# EAGLE design DRIVER_8 MOTOR_MEGA_DISTANCE_SENSOR_V1.0 (EAGLE 7.6.0)
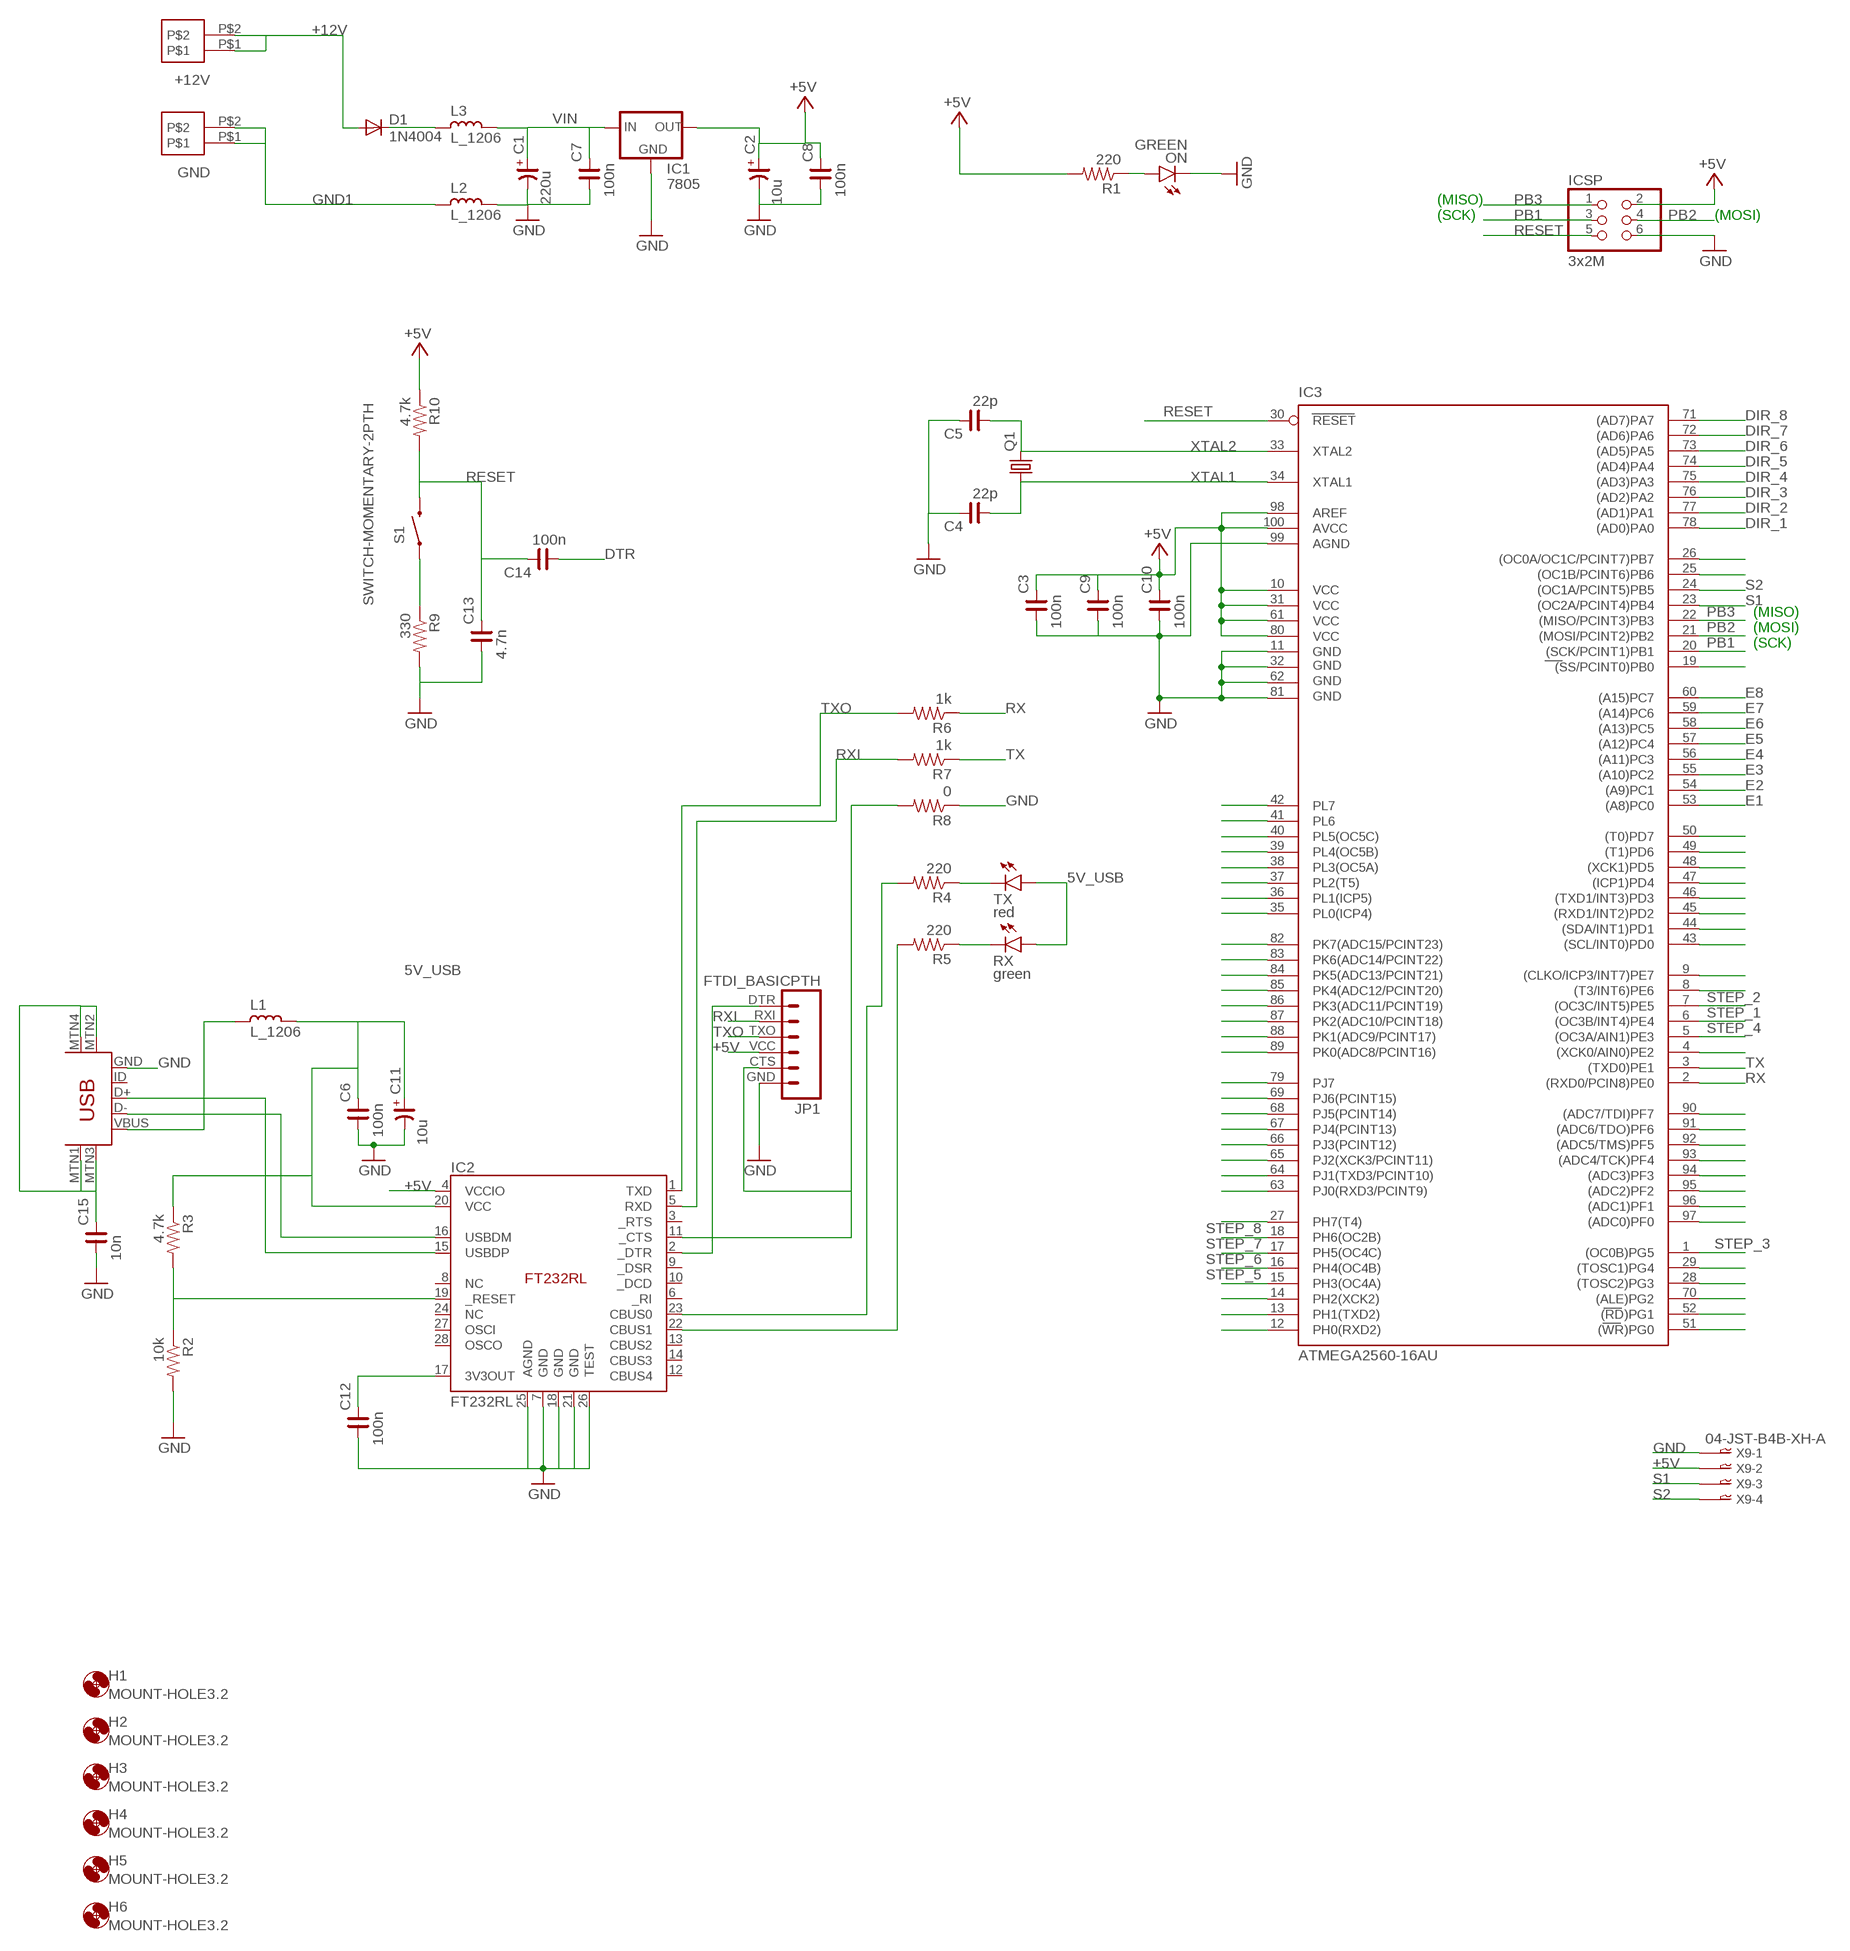
[diagram p0: schematic, sheet 1, part 1 of 2]
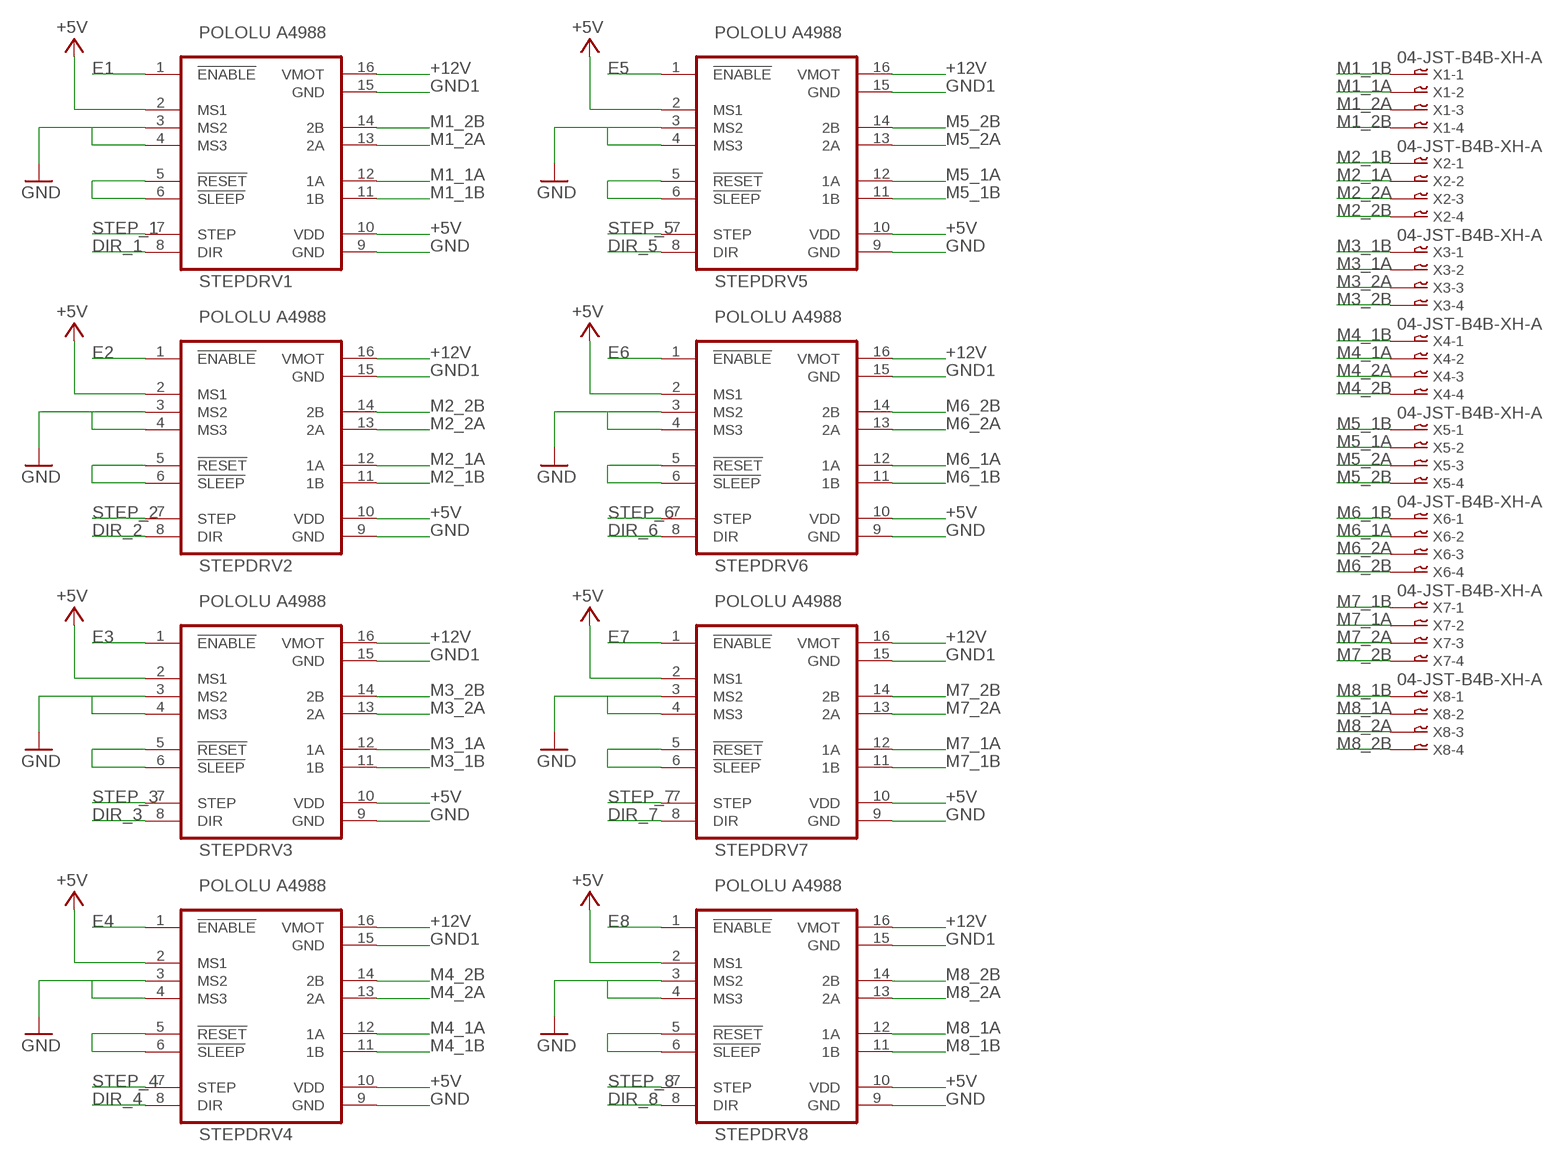
[diagram p1: schematic, sheet 1, part 2 of 2]

## Parts
+12V  SCREW_T_10MM  [SCREW_T_10MM]
C1  220u  CP_E-050X100  [CE-050X100]
C2  10u  CP_E-050X100  [CE-050X100]
C3  100n  C_C050-075X030  [C050-075X030]
C4  22p  C_C050-075X030  [C050-075X030]
C5  22p  C_C050-075X030  [C050-075X030]
C6  100n  C_C050-075X030  [C050-075X030]
C7  100n  C_C050-075X030  [C050-075X030]
C8  100n  C_C050-075X030  [C050-075X030]
C9  100n  C_C050-075X030  [C050-075X030]
C10  100n  C_C050-075X030  [C050-075X030]
C11  10u  CP_E-025X060  [CE-025X060]
C12  100n  C_C050-075X030  [C050-075X030]
C13  4.7n  C_C050-075X030  [C050-075X030]
C14  100n  C_C050-075X030  [C050-075X030]
C15  10n  C_C050-075X030  [C050-075X030]
D1  1N4004  [DO41-10]
GND  SCREW_T_10MM  [SCREW_T_10MM]
H1  MOUNT-HOLE3.2  [3,2]
H2  MOUNT-HOLE3.2  [3,2]
H3  MOUNT-HOLE3.2  [3,2]
H4  MOUNT-HOLE3.2  [3,2]
H5  MOUNT-HOLE3.2  [3,2]
H6  MOUNT-HOLE3.2  [3,2]
IC1  7805  V_REG_78XX-TO-220  [TO-220-ALT]
IC2  FT232RL  [SSOP-28]
IC3  ATMEGA2560-16AU  ATMEGA25602560-16AU  [TQFP100]
ICSP  3x2M  PINHD-2X3  [2X03]
JP1  FTDI_BASICPTH  [FTDI_BASIC]
L1  L_1206  [L1206]
L2  L_1206  [L1206]
L3  L_1206  [L1206]
ON  GREEN  LED3MM  [LED3MM]
Q1  CRYSTALHC49S  [HC49/S]
R1  220  0.75OHM1/4W1%(0805)  [0805]
R2  10k  0.75OHM1/4W1%(0805)  [0805]
R3  4.7k  0.75OHM1/4W1%(0805)  [0805]
R4  220  0.75OHM1/4W1%(0805)  [0805]
R5  220  0.75OHM1/4W1%(0805)  [0805]
R6  1k  0.75OHM1/4W1%(0805)  [0805]
R7  1k  0.75OHM1/4W1%(0805)  [0805]
R8  0  0.75OHM1/4W1%(0805)  [0805]
R9  330  0.75OHM1/4W1%(0805)  [0805]
R10  4.7k  0.75OHM1/4W1%(0805)  [0805]
RX  green  LED3MM  [LED3MM]
S1  SWITCH-MOMENTARY-2PTH  [TACTILE-PTH]
STEPDRV1  POLOLU A4988  POLOLULU2128  [POLOLULU2128]
STEPDRV2  POLOLU A4988  POLOLULU2128  [POLOLULU2128]
STEPDRV3  POLOLU A4988  POLOLULU2128  [POLOLULU2128]
STEPDRV4  POLOLU A4988  POLOLULU2128  [POLOLULU2128]
STEPDRV5  POLOLU A4988  POLOLULU2128  [POLOLULU2128]
STEPDRV6  POLOLU A4988  POLOLULU2128  [POLOLULU2128]
STEPDRV7  POLOLU A4988  POLOLULU2128  [POLOLULU2128]
STEPDRV8  POLOLU A4988  POLOLULU2128  [POLOLULU2128]
TX  red  LED3MM  [LED3MM]
U$1  USB-MINIB-5PIN  [USB-MINIB]
X1  04-JST-B4B-XH-A  [B4B-XH]
X2  04-JST-B4B-XH-A  [B4B-XH]
X3  04-JST-B4B-XH-A  [B4B-XH]
X4  04-JST-B4B-XH-A  [B4B-XH]
X5  04-JST-B4B-XH-A  [B4B-XH]
X6  04-JST-B4B-XH-A  [B4B-XH]
X7  04-JST-B4B-XH-A  [B4B-XH]
X8  04-JST-B4B-XH-A  [B4B-XH]
X9  04-JST-B4B-XH-A  [B4B-XH]

## Nets
5V_USB: C6.2 C11.+ IC2.20(VCC) L1.1 R3.1 RX.A TX.A
+5V [power usb]: C2.+ C3.2 C8.2 C9.2 C10.2 IC1.OUT IC2.4(VCCIO) IC3.10(VCC) IC3.31(VCC1) IC3.61(VCC2) IC3.80(VCC3) IC3.98(AREF) IC3.100(AVCC) ICSP.2 JP1.VCC R1.2 R10.1 STEPDRV1.2(MS1) STEPDRV1.10(VDD) STEPDRV2.2(MS1) STEPDRV2.10(VDD) STEPDRV3.2(MS1) STEPDRV3.10(VDD) STEPDRV4.2(MS1) STEPDRV4.10(VDD) STEPDRV5.2(MS1) STEPDRV5.10(VDD) STEPDRV6.2(MS1) STEPDRV6.10(VDD) STEPDRV7.2(MS1) STEPDRV7.10(VDD) STEPDRV8.2(MS1) STEPDRV8.10(VDD) X9.P$2
+12V: +12V.P$1 +12V.P$2 D1.A STEPDRV1.16(VMOT) STEPDRV2.16(VMOT) STEPDRV3.16(VMOT) STEPDRV4.16(VMOT) STEPDRV5.16(VMOT) STEPDRV6.16(VMOT) STEPDRV7.16(VMOT) STEPDRV8.16(VMOT)
DIR_1: IC3.78((AD0)PA0) STEPDRV1.8(DIR)
DIR_2: IC3.77((AD1)PA1) STEPDRV2.8(DIR)
DIR_3: IC3.76((AD2)PA2) STEPDRV3.8(DIR)
DIR_4: IC3.75((AD3)PA3) STEPDRV4.8(DIR)
DIR_5: IC3.74((AD4)PA4) STEPDRV5.8(DIR)
DIR_6: IC3.73((AD5)PA5) STEPDRV6.8(DIR)
DIR_7: IC3.72((AD6)PA6) STEPDRV7.8(DIR)
DIR_8: IC3.71((AD7)PA7) STEPDRV8.8(DIR)
DTR: C14.1 IC2.2(_DTR) JP1.DTR
E1: IC3.53((A8)PC0) STEPDRV1.1(!ENABLE)
E2: IC3.54((A9)PC1) STEPDRV2.1(!ENABLE)
E3: IC3.55((A10)PC2) STEPDRV3.1(!ENABLE)
E4: IC3.56((A11)PC3) STEPDRV4.1(!ENABLE)
E5: IC3.57((A12)PC4) STEPDRV5.1(!ENABLE)
E6: IC3.58((A13)PC5) STEPDRV6.1(!ENABLE)
E7: IC3.59((A14)PC6) STEPDRV7.1(!ENABLE)
E8: IC3.60((A15)PC7) STEPDRV8.1(!ENABLE)
GND [gnd]: C1.- C2.- C3.1 C4.2 C5.2 C6.1 C7.1 C8.1 C9.1 C10.1 C11.- C12.1 C13.1 C15.1 IC1.GND IC2.7(GND) IC2.18(GND) IC2.21(GND) IC2.25(AGND) IC2.26(TEST) IC3.11(GND) IC3.32(GND1) IC3.62(GND2) IC3.81(GND3) IC3.99(AGND) ICSP.6 JP1.GND L2.1 ON.K(C) R2.2 R8.1 R9.2 STEPDRV1.3(MS2) STEPDRV1.4(MS3) STEPDRV1.9(GND) STEPDRV2.3(MS2) STEPDRV2.4(MS3) STEPDRV2.9(GND) STEPDRV3.3(MS2) STEPDRV3.4(MS3) STEPDRV3.9(GND) STEPDRV4.3(MS2) STEPDRV4.4(MS3) STEPDRV4.9(GND) STEPDRV5.3(MS2) STEPDRV5.4(MS3) STEPDRV5.9(GND) STEPDRV6.3(MS2) STEPDRV6.4(MS3) STEPDRV6.9(GND) STEPDRV7.3(MS2) STEPDRV7.4(MS3) STEPDRV7.9(GND) STEPDRV8.3(MS2) STEPDRV8.4(MS3) STEPDRV8.9(GND) U$1.GND X9.P$1
GND1: GND.P$1 GND.P$2 L2.2 STEPDRV1.15(GND) STEPDRV2.15(GND) STEPDRV3.15(GND) STEPDRV4.15(GND) STEPDRV5.15(GND) STEPDRV6.15(GND) STEPDRV7.15(GND) STEPDRV8.15(GND)
M1_1A: STEPDRV1.12(1A) X1.P$2
M1_1B: STEPDRV1.11(1B) X1.P$1
M1_2A: STEPDRV1.13(2A) X1.P$3
M1_2B: STEPDRV1.14(2B) X1.P$4
M2_1A: STEPDRV2.12(1A) X2.P$2
M2_1B: STEPDRV2.11(1B) X2.P$1
M2_2A: STEPDRV2.13(2A) X2.P$3
M2_2B: STEPDRV2.14(2B) X2.P$4
M3_1A: STEPDRV3.12(1A) X3.P$2
M3_1B: STEPDRV3.11(1B) X3.P$1
M3_2A: STEPDRV3.13(2A) X3.P$3
M3_2B: STEPDRV3.14(2B) X3.P$4
M4_1A: STEPDRV4.12(1A) X4.P$2
M4_1B: STEPDRV4.11(1B) X4.P$1
M4_2A: STEPDRV4.13(2A) X4.P$3
M4_2B: STEPDRV4.14(2B) X4.P$4
M5_1A: STEPDRV5.12(1A) X5.P$2
M5_1B: STEPDRV5.11(1B) X5.P$1
M5_2A: STEPDRV5.13(2A) X5.P$3
M5_2B: STEPDRV5.14(2B) X5.P$4
M6_1A: STEPDRV6.12(1A) X6.P$2
M6_1B: STEPDRV6.11(1B) X6.P$1
M6_2A: STEPDRV6.13(2A) X6.P$3
M6_2B: STEPDRV6.14(2B) X6.P$4
M7_1A: STEPDRV7.12(1A) X7.P$2
M7_1B: STEPDRV7.11(1B) X7.P$1
M7_2A: STEPDRV7.13(2A) X7.P$3
M7_2B: STEPDRV7.14(2B) X7.P$4
M8_1A: STEPDRV8.12(1A) X8.P$2
M8_1B: STEPDRV8.11(1B) X8.P$1
M8_2A: STEPDRV8.13(2A) X8.P$3
M8_2B: STEPDRV8.14(2B) X8.P$4
N$1: L1.2 U$1.VBUS
N$2: IC2.16(USBDM) U$1.D-
N$3: ON.A R1.1
N$4: STEPDRV2.5(!RESET) STEPDRV2.6(!SLEEP)
N$5: STEPDRV3.5(!RESET) STEPDRV3.6(!SLEEP)
N$6: IC2.15(USBDP) U$1.D+
N$7: IC3.14(PH2(XCK2))
N$8: STEPDRV1.5(!RESET) STEPDRV1.6(!SLEEP)
N$9: STEPDRV4.5(!RESET) STEPDRV4.6(!SLEEP)
N$10: STEPDRV5.5(!RESET) STEPDRV5.6(!SLEEP)
N$11: STEPDRV6.5(!RESET) STEPDRV6.6(!SLEEP)
N$12: STEPDRV7.5(!RESET) STEPDRV7.6(!SLEEP)
N$13: STEPDRV8.5(!RESET) STEPDRV8.6(!SLEEP)
N$14: C12.2 IC2.17(3V3OUT)
N$15: D1.C L3.2
N$16: R4.1 TX.K(C)
N$17: R5.1 RX.K(C)
N$18: C15.2 U$1.MTN1(MTN2) U$1.MTN2(MTN3) U$1.MTN3(MTN1) U$1.MTN4
N$19: IC3.27(PH7(T4))
N$20: IC3.49((T1)PD6)
N$21: IC3.48((XCK1)PD5)
N$22: IC3.47((ICP1)PD4)
N$23: IC3.46((TXD1/INT3)PD3)
N$24: IC3.45((RXD1/INT2)PD2)
N$25: IC3.44((SDA/INT1)PD1)
N$26: IC3.43((SCL/INT0)PD0)
N$27: IC3.9((CLKO/ICP3/INT7)PE7)
N$28: IC3.8((T3/INT6)PE6)
N$29: IC3.4((XCK0/AIN0)PE2)
N$30: IC2.23(CBUS0) R4.2
N$31: IC2.22(CBUS1) R5.2
N$32: IC3.90((ADC7/TDI)PF7)
N$33: IC3.91((ADC6/TDO)PF6)
N$34: IC3.92((ADC5/TMS)PF5)
N$35: IC3.93((ADC4/TCK)PF4)
N$36: IC3.94((ADC3)PF3)
N$37: IC3.95((ADC2)PF2)
N$38: IC3.96((ADC1)PF1)
N$39: IC3.97((ADC0)PF0)
N$40: IC3.29((TOSC1)PG4)
N$41: IC3.28((TOSC2)PG3)
N$42: IC3.65(PJ2(XCK3/PCINT11))
N$43: IC3.66(PJ3(PCINT12))
N$44: IC3.67(PJ4(PCINT13))
N$45: IC3.68(PJ5(PCINT14))
N$46: IC3.69(PJ6(PCINT15))
N$47: IC3.79(PJ7)
N$48: IC3.89(PK0(ADC8/PCINT16))
N$49: IC3.88(PK1(ADC9/PCINT17))
N$50: IC3.87(PK2(ADC10/PCINT18))
N$51: IC3.86(PK3(ADC11/PCINT19))
N$52: IC3.85(PK4(ADC12/PCINT20))
N$53: IC3.84(PK5(ADC13/PCINT21))
N$54: IC3.83(PK6(ADC14/PCINT22))
N$55: IC3.82(PK7(ADC15/PCINT23))
N$57: IC2.11(_CTS) JP1.CTS R8.2
N$59: R9.1 S1.1
N$60: IC2.19(_RESET) R2.1 R3.2
PB0: IC3.19((SS/PCINT0)PB0)
PB1: IC3.20((SCK/PCINT1)PB1) ICSP.3
PB2: IC3.21((MOSI/PCINT2)PB2) ICSP.4
PB3: IC3.22((MISO/PCINT3)PB3) ICSP.1
PB6: IC3.25((OC1B/PCINT6)PB6)
PB7: IC3.26((OC0A/OC1C/PCINT7)PB7)
PD7: IC3.50((T0)PD7)
PG0: IC3.51((WR)PG0)
PG1: IC3.52((RD)PG1)
PG2: IC3.70((ALE)PG2)
PL0: IC3.35(PL0(ICP4))
PL1: IC3.36(PL1(ICP5))
PL2: IC3.37(PL2(T5))
PL3: IC3.38(PL3(OC5A))
PL4: IC3.39(PL4(OC5B))
PL5: IC3.40(PL5(OC5C))
PL6: IC3.41(PL6)
PL7: IC3.42(PL7)
RESET: C13.2 C14.2 IC3.30(RESET) ICSP.5 R10.2 S1.3
RX: IC3.2((RXD0/PCIN8)PE0) R6.1
RXD2: IC3.12(PH0(RXD2))
RXD3: IC3.63(PJ0(RXD3/PCINT9))
RXI: IC2.5(RXD) JP1.RXI R7.2
S1: IC3.23((OC2A/PCINT4)PB4) X9.P$3
S2: IC3.24((OC1A/PCINT5)PB5) X9.P$4
STEP_1: IC3.6((OC3B/INT4)PE4) STEPDRV1.7(STEP)
STEP_2: IC3.7((OC3C/INT5)PE5) STEPDRV2.7(STEP)
STEP_3: IC3.1((OC0B)PG5) STEPDRV3.7(STEP)
STEP_4: IC3.5((OC3A/AIN1)PE3) STEPDRV4.7(STEP)
STEP_5: IC3.15(PH3(OC4A)) STEPDRV5.7(STEP)
STEP_6: IC3.16(PH4(OC4B)) STEPDRV6.7(STEP)
STEP_7: IC3.17(PH5(OC4C)) STEPDRV7.7(STEP)
STEP_8: IC3.18(PH6(OC2B)) STEPDRV8.7(STEP)
TX: IC3.3((TXD0)PE1) R7.1
TXD2: IC3.13(PH1(TXD2))
TXD3: IC3.64(PJ1(TXD3/PCINT10))
TXO: IC2.1(TXD) JP1.TXO R6.2
VIN [power]: C1.+ C7.2 IC1.IN L3.1
XTAL1: C4.1 IC3.34(XTAL1) Q1.1
XTAL2: C5.1 IC3.33(XTAL2) Q1.2
Unconnected: IC2.3(_RTS) IC2.6(_RI) IC2.8(NC) IC2.9(_DSR) IC2.10(_DCD) IC2.12(CBUS4) IC2.13(CBUS2) IC2.14(CBUS3) IC2.24(NC) IC2.27(OSCI) IC2.28(OSCO) U$1.ID

## Notes on the sheet
- (MISO)
- (SCK) | (MOSI)
- (MISO)
- (MOSI)
- (SCK)

## Library data of the parts
+12V GND = screw_2p_10mm:SCREW_T_10MM
C1 C2 C11 = rc-master:CP_: POLARIZED CAP
C3-C10 C12-C15 = rc-master:C_: NON-POLARIZED CAP
D1 = diode:1N4004: DIODE general purpose rectifier, 1 A
H1-H6 = holes:MOUNT-HOLE: MOUNTING HOLE with drill center marker
IC1 = SparkFun-PowerIC:V_REG_78XX: Voltage Regulator Standard 7805 5V regulator. IGO (Input Ground Output). Spark Fun Electronics SKU : COM-00107
IC2 = ftdi4:FT232RL
IC3 = SmartPrj:ATMEGA2560: MICROCONTROLLER 64/128/256 Kbytes FLASH 4 Kbytes EEPROM 8 Kbytes SRAM 86 General Purpose I/O pins 12-channels16-bit PWM 4 x Serial USARTs 16-channels 10-bit A/D
ICSP = SmartPrj:PINHD-2X3: PIN HEADER
JP1 = SparkFun-Connectors:FTDI_BASIC: FTDI Basic header with labels
L1-L3 = rc-master-smd:L_: INDUCTOR
ON RX TX = SparkFun-LED:LED: LEDs Standard schematic elements and footprints for 5mm, 3mm, 1206, and 0603 sized LEDs. 5mm - Spark Fun Electronics SKU : COM-00529 (and others)
Q1 = crystal:CRYSTAL: CRYSTAL; OC_FARNELL: 1667008; OC_NEWARK: unknown
R1-R10 = SparkFun-Resistors:0.75OHM1/4W1%(0805): RES-08474; PROD_ID: RES-08474; VALUE: 0.75
S1 = SparkFun-Electromechanical:SWITCH-MOMENTARY-2: Various NO switches- pushbuttons, reed, etc
STEPDRV1-STEPDRV8 = stepper_drivers_etc:POLOLULU2128
U$1 = SparkFun-Connectors:USB-MINIB: Mini-USB "B" connector with 5th pin broken out. Created new symbol breaking out 5th "ID" pin in mini/micro USB connector spec. See: http://en.wikipedia.org/wiki/Mini_usb#Cables. Uses same footprint as 4-pin symbol. Also added pins to connect to mounting / shield pads if required (probably not generally needed as signals aren't shielded once they leave the connector).
X1-X9 = con-jst-xh:04-JST: JST CONNECTOR

## Net classes
0 default: width 0.203 mm, drill 0.406 mm, clearance 0.203 mm
1 power: width 0.61 mm, drill 0.406 mm, clearance 0.203 mm
2 gnd: width 0.305 mm, drill 0.406 mm, clearance 0.203 mm
3 power usb: width 0.508 mm, drill 0.406 mm, clearance 0.203 mm

## Board
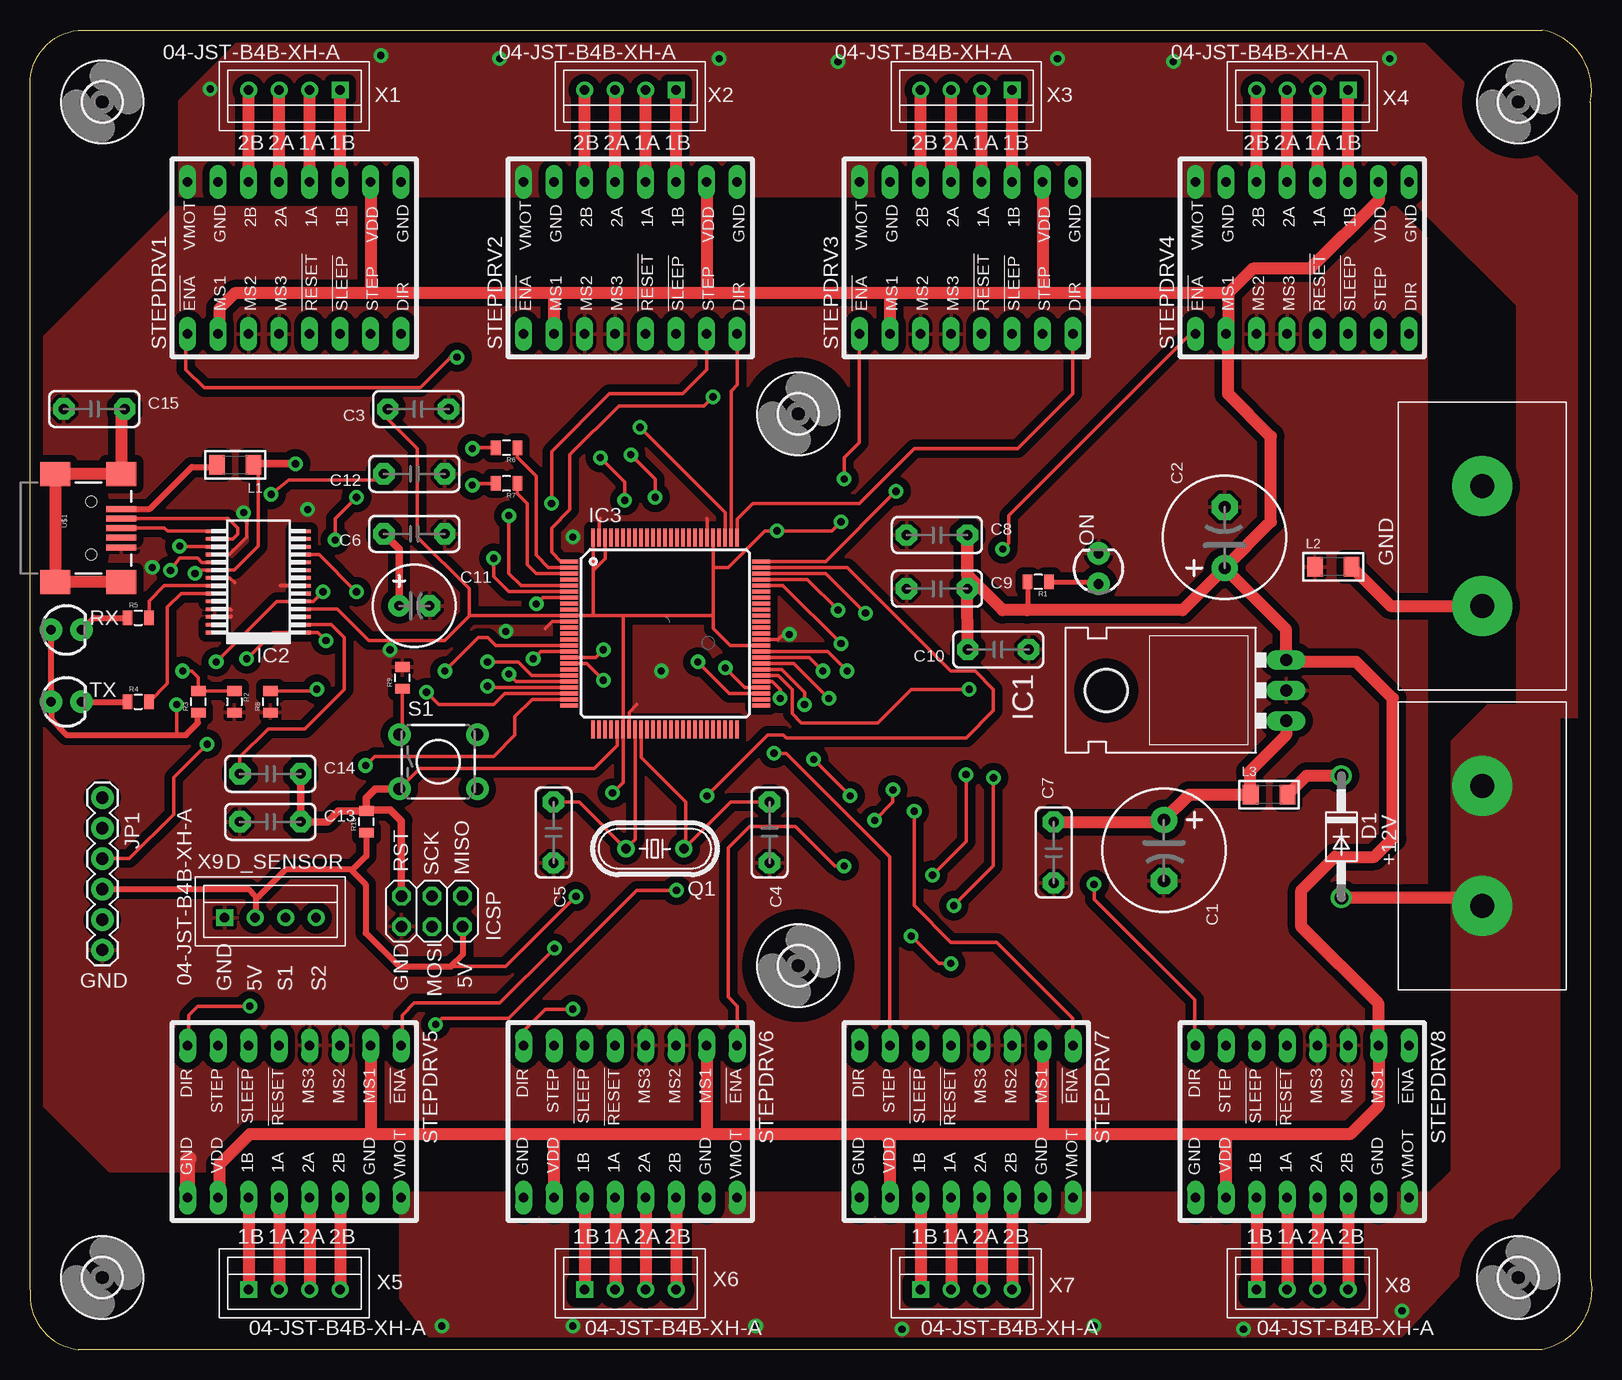
[diagram p2: board, top side]
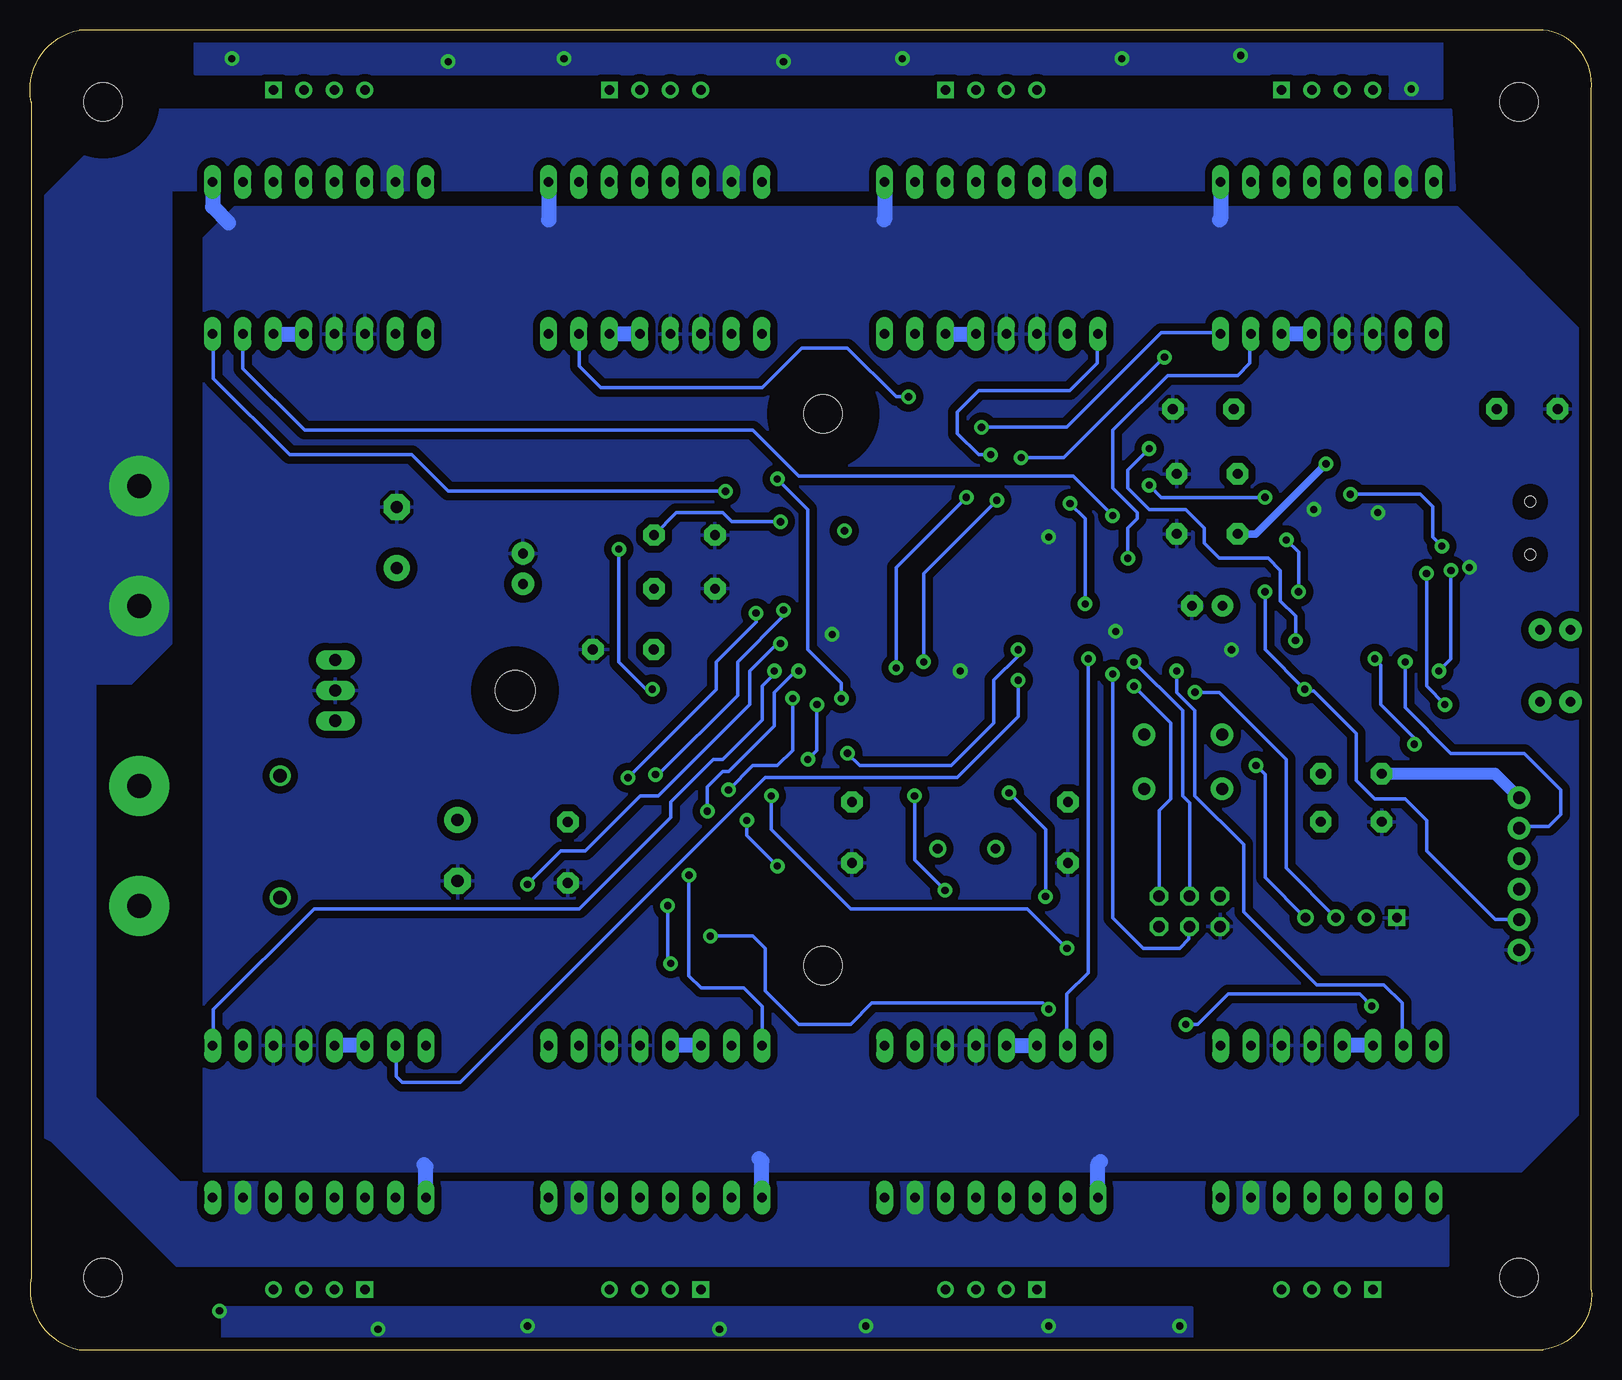
[diagram p3: board, bottom side, seen from below]

Size 130.13 x 110 mm. Coordinates in mm from the lower left corner, seen from the top.
Outline: 130.03,104 130.03,6 arc-90 126.03,0 4.03,0 arc-90 0.03,5 0.03,105 arc-90 4.03,110 126.03,110 arc-90 130.03,104
Copper layers (1*16): Top 0.035mm / dielectric 1.5mm / Bottom 0.035mm
Design rules "default *": minimum track width 10mil, minimum drill 28mil, track to track 8mil, track to pad 8mil, pad to pad 8mil, via to via 8mil, smd to smd 8mil, copper to edge 40mil, drill to drill 12mil, minimum pad ring 12mil, minimum via ring 12mil, stop-mask expansion 4mil, vias tented up to drill 0mil, thermal gap 12mil

### Footprints (pad centres in the part's own frame; a part is rotated, then mirrored left to right if it is on the bottom)
SCREW_T_10MM = drill 2 pad 5: P$1 3,3; P$2 13,3
CE-050X100 = drill 1.016 pad 2.184: + -2.54,0 | drill 1.016 pad 2.184 octagon: - 2.54,0
C050-075X030 = drill 0.813 pad 1.778 octagon: 1 -2.54,0; 2 2.54,0
CE-025X060 = drill 0.813 pad 1.778: + -1.27,0 | drill 0.813 pad 1.778 octagon: - 1.27,0
DO41-10 = drill 1.118: A 5.08,0; C -5.08,0
3,2 = hole 3.2: 0,0
TO-220-ALT = drill 1.016 long: GND 0,-3.81; IN -2.54,-3.81; OUT 2.54,-3.81 | hole 3.302: 0,11.176
SSOP-28 = smd 0.3 x 1.5: 1 -4.225,-3.625; 2 -3.575,-3.625; 3 -2.925,-3.625; 4 -2.275,-3.625; 5 -1.625,-3.625; 6 -0.975,-3.625; 7 -0.325,-3.625; 8 0.325,-3.625; 9 0.975,-3.625; 10 1.625,-3.625; 11 2.275,-3.625; 12 2.925,-3.625; 13 3.575,-3.625; 14 4.225,-3.625; 15 4.225,3.625; 16 3.575,3.625; 17 2.925,3.625; 18 2.275,3.625; 19 1.625,3.625; 20 0.975,3.625; 21 0.325,3.625; 22 -0.325,3.625; 23 -0.975,3.625; 24 -1.625,3.625; 25 -2.275,3.625; 26 -2.925,3.625; 27 -3.575,3.625; 28 -4.225,3.625
TQFP100 = smd 1.5 x 0.3: 1 -8,6; 2 -8,5.5; 3 -8,5; 4 -8,4.5; 5 -8,4; 6 -8,3.5; 7 -8,3; 8 -8,2.5; 9 -8,2; 10 -8,1.5; 11 -8,1; 12 -8,0.5; 13 -8,0; 14 -8,-0.5; 15 -8,-1; 16 -8,-1.5; 17 -8,-2; 18 -8,-2.5; 19 -8,-3; 20 -8,-3.5; 21 -8,-4; 22 -8,-4.5; 23 -8,-5; 24 -8,-5.5; 25 -8,-6; 51 8,-6; 52 8,-5.5; 53 8,-5; 54 8,-4.5; 55 8,-4; 56 8,-3.5; 57 8,-3; 58 8,-2.5; 59 8,-2; 60 8,-1.5; 61 8,-1; 62 8,-0.5; 63 8,0; 64 8,0.5; 65 8,1; 66 8,1.5; 67 8,2; 68 8,2.5; 69 8,3; 70 8,3.5; 71 8,4; 72 8,4.5; 73 8,5; 74 8,5.5; 75 8,6 | smd 0.3 x 1.5: 26 -6,-8; 27 -5.5,-8; 28 -5,-8; 29 -4.5,-8; 30 -4,-8; 31 -3.5,-8; 32 -3,-8; 33 -2.5,-8; 34 -2,-8; 35 -1.5,-8; 36 -1,-8; 37 -0.5,-8; 38 0,-8; 39 0.5,-8; 40 1,-8; 41 1.5,-8; 42 2,-8; 43 2.5,-8; 44 3,-8; 45 3.5,-8; 46 4,-8; 47 4.5,-8; 48 5,-8; 49 5.5,-8; 50 6,-8; 76 6,8; 77 5.5,8; 78 5,8; 79 4.5,8; 80 4,8; 81 3.5,8; 82 3,8; 83 2.5,8; 84 2,8; 85 1.5,8; 86 1,8; 87 0.5,8; 88 0,8; 89 -0.5,8; 90 -1,8; 91 -1.5,8; 92 -2,8; 93 -2.5,8; 94 -3,8; 95 -3.5,8; 96 -4,8; 97 -4.5,8; 98 -5,8; 99 -5.5,8; 100 -6,8
2X03 = drill 0.95 pad 1.55 octagon: 1 -2.54,-1.27; 2 -2.54,1.27; 3 0,-1.27; 4 0,1.27; 5 2.54,-1.27; 6 2.54,1.27
FTDI_BASIC = drill 1.016 pad 1.88: CTS 10.16,0; DTR 0,0; GND 12.7,0; RXI 2.54,0; TXO 5.08,0; VCC 7.62,0
L1206 = smd 1.3 x 1.6: 1 -1.524,0; 2 1.524,0
LED3MM = drill 0.813 pad 1.88: A -1.27,0; K 1.27,0
HC49/S = drill 0.813: 1 -2.413,0; 2 2.413,0
0805 = smd 0.8 x 1.2: 1 -0.9,0; 2 0.9,0
TACTILE-PTH = drill 1.016 pad 1.88: 1 -3.251,2.261; 2 3.251,2.261; 3 -3.251,-2.261; 4 3.251,-2.261
POLOLULU2128 = drill 0.8 long: 1 -6.35,8.89; 2 -6.35,6.35; 3 -6.35,3.81; 4 -6.35,1.27; 5 -6.35,-1.27; 6 -6.35,-3.81; 7 -6.35,-6.35; 8 -6.35,-8.89; 9 6.35,-8.89; 10 6.35,-6.35; 11 6.35,-3.81; 12 6.35,-1.27; 13 6.35,1.27; 14 6.35,3.81; 15 6.35,6.35; 16 6.35,8.89
USB-MINIB = smd 2.5 x 0.5: D+ 2.5,0; D- 2.5,0.8; GND 2.5,-1.6; ID 2.5,-0.8; VBUS 2.5,1.6 | smd 2.5 x 2: MTN1 -3,4.5; MTN2 2.5,4.5; MTN3 -3,-4.5; MTN4 2.5,-4.5 | hole 0.9: 0,2.2; 0,-2.2
B4B-XH = drill 0.8 square: P$1 -3.81,0 | drill 0.8: P$2 -1.27,0; P$3 1.27,0; P$4 3.81,0

### Placement (x,y rotation side)
+12V  124.03,34 90 top
C1  94.5,41.61 270 top
C2  99.56,67.69 90 top
C3  32.35,78.4 180 top
C4  61.63,43.1 270 top
C5  43.63,43.1 270 top
C6  32.03,68 180 top
C7  85.3,41.44 90 top
C8  75.58,67.9 0 top
C9  75.58,63.43 0 top
C10  80.68,58.35 180 top
C11  32.03,62 0 top
C12  32.03,73 180 top
C13  20.03,44 0 top
C14  20.03,48 0 top
C15  5.36,78.41 0 top
D1  109.28,42.75 270 top
GND  124.03,59 90 top
H1  6.03,6 0 top
H2  124.03,6 0 top
H3  64.03,32 0 top
H4  6.03,104 0 top
H5  64.03,78 0 top
H6  124.03,104 0 top
IC1  100.88,54.95 90 top
IC2  19.03,64 90 top
IC3  52.93,59.69 0 top
ICSP  33.5,36.53 180 top
JP1  6.03,46 270 top
L1  17.1,73.75 180 top
L2  108.61,65.25 0 top
L3  103.26,46.25 0 top
ON  89.05,65.09 90 top
Q1  52.08,41.75 180 top
R1  84.03,64 180 top
R2  17.03,54 270 top
R3  14.03,54 90 top
R4  9.03,54 0 top
R5  9.03,61 0 top
R6  39.71,75.17 180 top
R7  39.71,72.19 180 top
R8  20.03,54 90 top
R9  31.03,56 90 top
R10  28.03,44 90 top
RX  3.03,60 0 top
S1  34.03,49 0 top
STEPDRV1  22.03,91 90 top
STEPDRV2  50.03,91 90 top
STEPDRV3  78.03,91 90 top
STEPDRV4  106.03,91 90 top
STEPDRV5  22.03,19 270 top
STEPDRV6  50.03,19 270 top
STEPDRV7  78.03,19 270 top
STEPDRV8  106.03,19 270 top
TX  3.03,54 0 top
U$1  5.12,68.47 0 top
X1  22.03,105 180 top
X2  50.03,105 180 top
X3  78.03,105 180 top
X4  106.03,105 180 top
X5  22.03,5 0 top
X6  50.03,5 0 top
X7  78.03,5 0 top
X8  106.03,5 0 top
X9  20.03,36 0 top

### Tracks (layer width: path | path; a pad name or v marks a point on that pad's centre or on a via)
5V_USB  (via drill 0.6)
  Top 0.305: L1.1 19.03,73.34 19.03,67 17,64.97 IC2.20 14.03,64.97 v13.74,64.69 | v12.22,53.77 12.22,51.23
  Top 0.508: RX.A TX.A 1.76,52.55 3.07,51.23 12.22,51.23 12.98,51.23 14,52.24 14,53.07 R3.1
  Top 0.61: v22.12,73.83 18.7,73.83 L1.1 | C11.+ 30.76,66.73 C6.2
  Bottom 0.305: v13.74,64.69 13.74,55.29 v12.22,53.77
  Bottom 0.61: C6.2 27.96,68 v22.12,73.83
+5V  (via drill 0.6)
  Top 0.305: IC3.80 56.93,65.2 | 56.93,65.2 56.93,61.19 | 56.93,61.19 56.93,60.11 58.35,58.69 IC3.61 | 46.93,61.19 IC3.10 36.66,61.19 | 46.93,61.19 49.56,61.19 | 49.56,61.19 56.93,61.19 | 36.66,61.19 34.57,59.1 28.22,59.1 25.6,61.73 IC2.4 | IC3.100 46.93,64.94 | 46.93,64.94 46.93,61.19 | 49.56,61.19 49.43,61.06 IC3.31 49.43,47.29 v48.54,46.4 | C3.2 29.81,77.58 32.28,75.1 32.28,67.74 36.6,63.42 36.6,61.25 36.66,61.19 | 30.76,31.92 39.65,31.92 v45.49,37.77 | IC3.98 47.93,65.94 46.93,64.94 | v67.59,69.01 66.83,68.25 v62.26,68.25 61.24,68.25 58.19,65.2 56.93,65.2
  Top 0.406: R1.2 83.13,61.68 83.08,61.64
  Top 0.508: JP1.VCC 18.21,38.38 18.82,37.77 | 18.82,37.77 18.82,36.07 X9.P$2 | 18.82,37.77 19.08,37.77 21.36,40.05 26.7,40.05 26.82,39.92 | 26.82,39.92 27.97,38.78 27.97,34.72 30.76,31.92 35.08,31.92 36.09,32.94 36.09,35.2 ICSP.2 | R10.1 28.03,41.13 26.82,39.92
  Top 1.016: C2.+ 104.69,60.02 IC1.OUT 104.85,57.32 110.52,57.32 113.56,54.28 113.56,42.59 112.04,41.07 108.74,41.07 105.94,38.27 105.94,35.23 112.38,28.79 STEPDRV8.2 112.38,20.32 110.01,17.95 99.34,17.95 | C2.+ 96.05,61.64 83.08,61.64 81.05,61.64 78.09,64.6 C8.2 C9.2 C10.2 | C2.+ 103.4,69.01 103.4,76.12 99.85,79.68 99.85,84.48 STEPDRV4.2 99.85,84.82 99.85,88.06 | STEPDRV4.10 112.38,95.76 106.71,90.09 101.88,90.09 99.85,88.06 | 99.85,88.06 84.1,88.06 | 84.1,88.06 71.91,88.06 | 71.91,88.06 56.67,88.06 | 56.67,88.06 43.71,88.06 | 43.71,88.06 28.47,88.06 | 28.47,88.06 17.04,88.06 15.77,86.79 15.77,84.75 STEPDRV1.2 | STEPDRV1.10 28.38,88.16 28.47,88.06 | STEPDRV2.2 43.68,88.02 43.71,88.06 | STEPDRV2.10 56.38,88.35 56.67,88.06 | STEPDRV3.2 71.68,87.83 71.91,88.06 | STEPDRV3.10 84.38,88.33 84.1,88.06 | 99.34,17.95 84.61,17.95 | 84.61,17.95 71.15,17.95 | 71.15,17.95 56.67,17.95 | 56.67,17.95 43.71,17.95 | 43.71,17.95 28.47,17.95 | 28.47,17.95 18.31,17.95 15.77,15.41 15.77,12.75 STEPDRV5.10 | STEPDRV5.2 28.38,18.05 28.47,17.95 | STEPDRV6.10 43.68,17.92 43.71,17.95 | STEPDRV6.2 56.38,18.25 56.67,17.95 | STEPDRV7.10 71.68,17.42 71.15,17.95 | STEPDRV7.2 84.38,18.19 84.61,17.95 | STEPDRV8.10 99.68,17.62 99.34,17.95
  Bottom 0.305: v45.49,37.77 45.49,43.35 v48.54,46.4 | v67.59,69.01 71.65,69.01 72.42,69.77 76.25,69.77 C8.2
+12V  (via drill 0.6)
  Top 1.016: D1.A 120.36,37.67 +12V.P$1
  other vias: 34.32,1.95 45.24,1.95 60.48,1.95 72.67,1.7 88.67,1.95 101.12,1.7 114.33,3.22 67.34,107.36 29.24,107.87 39.14,107.62 57.43,107.62 15.01,105.08 85.62,107.62 95.28,107.36 113.31,107.62
  pour Top (isolate 0.813, no thermals): 121.44,53.77 118.39,50.72 118.39,14.91 116.61,13.13 30.76,13.13 30.76,4.24 34.06,-0.08 113.31,-0.08 127.53,15.16 127.53,53.77
  pour Top (isolate 0.61, no thermals): 12.47,96.19 114.83,96.19 123.98,87.04 123.98,52.75 129.31,52.75 129.31,95.68 115.6,109.39 17.81,109.39 12.47,104.06
  pour Bottom (isolate 0.61, no thermals): 33.3,0.94 114.07,0.94 114.07,3.48 33.3,3.48
  pour Bottom (isolate 0.61, no thermals): 12.47,108.89 12.47,104.31 16.79,104.31 16.79,106.35 116.36,106.35 116.36,108.89
DIR_1  (via drill 0.6)
  Top 0.305: IC3.78 57.93,69.78 v50.83,76.88
  Bottom 0.305: v50.83,76.88 43.71,76.88 35.84,84.76 31.02,84.76 STEPDRV1.8
DIR_2
  Top 0.305: IC3.77 58.43,79.91 58.95,80.44 58.95,84.61 STEPDRV2.8
DIR_3
  Top 0.305: IC3.76 58.93,69.23 60.22,70.53 69.11,70.53 73.69,75.1 82.32,75.1 86.89,79.68 86.89,84.63 STEPDRV3.8
DIR_4  (via drill 0.6)
  Top 0.305: IC3.75 66.3,65.69 v72.16,71.55
  Bottom 0.305: v72.16,71.55 95.28,71.55 98.32,74.6 108.48,74.6 114.83,80.95 114.83,83.99 115.09,84.25 115.09,84.48 STEPDRV4.8
DIR_5  (via drill 0.6)
  Top 0.305: IC3.74 68.11,65.19 76.73,56.56 78.77,56.56 80.29,55.04 80.29,53.26 78,50.97 63.02,50.97 62.76,51.23 61.49,51.23 v56.41,46.15 | v53.87,38.27 50.57,38.27 39.9,27.61 34.32,27.61 v33.81,27.1 | v18.31,28.62 14,28.62 13.23,27.86 13.23,25.45 STEPDRV5.8
  Bottom 0.305: v56.41,46.15 56.41,40.81 v53.87,38.27 | v33.81,27.1 32.79,27.1 30.25,29.64 19.33,29.64 v18.31,28.62
DIR_6  (via drill 0.6)
  Top 0.305: IC3.73 66.32,64.69 v69.62,61.39 | v80.29,47.67 80.29,40.31 v76.99,37 | v76.73,32.18 75.72,32.18 v73.43,34.46 | v45.24,28.37 42.95,28.37 41.17,26.59 41.17,25.39 STEPDRV6.8
  Bottom 0.305: v69.62,61.39 69.62,60.63 72.92,57.32 72.92,55.04 v80.29,47.67 | v76.99,37 76.99,32.43 v76.73,32.18 | v73.43,34.46 69.88,34.46 68.86,33.45 68.86,29.89 66.07,27.1 61.75,27.1 59.97,28.88 45.75,28.88 v45.24,28.37
DIR_7  (via drill 0.6)
  Top 0.305: IC3.72 64.79,64.19 v67.34,61.64 | v78,47.93 78,42.34 v75.21,39.54
  Bottom 0.305: v67.34,61.64 67.34,61.13 71.15,57.32 71.15,54.53 77.75,47.93 v78,47.93 | v75.21,39.54 75.21,31.16 74.19,30.15 70.64,30.15 69.11,28.62 69.11,25.37 STEPDRV7.8
DIR_8  (via drill 0.6)
  Top 0.305: IC3.71 62.75,63.69 v67.59,58.85 | v88.67,38.78 88.67,37.51 97.05,29.13 97.05,25.43 STEPDRV8.8
  Bottom 0.305: v67.59,58.85 67.84,58.85 70.13,56.56 70.13,53.77 77.75,46.15 79.27,46.15 83.85,41.58 85.88,41.58 v88.67,38.78
DTR
  Top 0.305: C14.1 17.49,49.38 19.84,51.74 22.89,51.74 26.19,55.04 26.19,59.36 25.12,60.42 IC2.2
  Bottom 1.016: JP1.DTR 8.03,48 C14.1
E1  (via drill 0.6)
  Top 0.305: IC3.53 58.29,54.69 v55.65,57.32 | v49.56,70.79 49.56,72.31 v47.52,74.34 | v35.59,82.72 35.08,82.72 32.54,80.18 14.5,80.18 12.98,81.71 12.98,84.49 STEPDRV1.1
  Bottom 0.305: v55.65,57.32 55.65,64.69 v49.56,70.79 | v47.52,74.34 43.97,74.34 v35.59,82.72
E2  (via drill 0.6)
  Top 0.305: IC3.54 59.56,55.19 v57.94,56.82 | v52.1,71.04 52.1,72.56 v50.06,74.6
  Bottom 0.305: v57.94,56.82 57.94,65.2 v52.1,71.04 | v50.06,74.6 51.08,74.6 52.86,76.37 52.86,78.15 51.08,79.93 43.46,79.93 41.17,82.22 41.17,84.61 STEPDRV2.1
E3  (via drill 0.6)
  Top 0.305: IC3.55 61.86,55.69 62.51,55.04 v62.51,54.28 | v67.84,72.56 67.84,74.34 69.11,75.61 69.11,84.63 STEPDRV3.1
  Bottom 0.305: v62.51,54.28 62.51,55.55 65.3,58.34 65.3,70.02 v67.84,72.56
E4  (via drill 0.6)
  Top 0.305: STEPDRV4.1 96.69,84.65 81.56,69.52 81.56,67.23 v81.05,66.72 | v78.26,55.04 73.43,55.04 70.64,52.24 64.29,52.24 63.53,53.01 63.53,55.04 62.37,56.19 IC3.56
  Bottom 0.305: v81.05,66.72 81.05,57.32 78.77,55.04 v78.26,55.04
E5  (via drill 0.6)
  Top 0.305: IC3.57 62.64,56.69 64.54,54.78 v64.54,53.77 | v65.3,49.2 v68.35,46.15 | v43.71,33.45 39.14,28.88 32.03,28.88 31.01,27.86 31.01,25.45 STEPDRV5.1
  Bottom 0.305: v64.54,53.77 64.54,49.96 v65.3,49.2 | v68.35,46.15 68.35,43.35 61.75,36.75 47.02,36.75 v43.71,33.45
E6  (via drill 0.6)
  Top 0.305: IC3.58 63.66,57.19 v66.57,54.28 | v71.91,46.66 71.91,45.64 v70.38,44.12 | v67.84,40.31 67.08,40.31 63.78,43.61 59.97,43.61 58.19,41.83 58.19,29.38 58.95,28.62 58.95,25.39 STEPDRV6.1
  Bottom 0.305: v66.57,54.28 66.57,49.96 67.84,48.69 69.88,48.69 v71.91,46.66 | v70.38,44.12 70.38,42.85 v67.84,40.31
E7  (via drill 0.6)
  Top 0.305: IC3.59 64.94,57.69 v66.07,56.56 | v73.69,44.88 73.69,37 76.73,33.96 80.54,33.96 86.89,27.61 86.89,25.37 STEPDRV7.1
  Bottom 0.305: v66.07,56.56 66.32,56.56 68.1,54.78 68.1,51.99 71.91,48.18 72.42,48.18 73.69,46.91 v73.69,44.88
E8  (via drill 0.6)
  Top 0.305: IC3.60 66.47,58.19 v68.1,56.56
  Bottom 0.305: v68.1,56.56 68.1,56.31 69.11,55.29 69.11,52.5 72.42,49.2 73.18,49.2 76.73,45.64 76.73,44.37 84.35,36.75 106.45,36.75 114.83,28.37 114.83,25.43 STEPDRV8.1
GND  (via drill 0.6)
  Top 0.305: IC3.32 49.93,53.12 50.57,53.77 | IC2.7 20.86,63.67 20.85,63.67 | IC2.21 16.65,64.33 17.04,63.93 | IC2.26 16.73,61.08 16.79,61.13 | IC2.25 16.71,61.73 16.79,61.64 | IC2.18 16.6,66.28 18.06,67.74 18.06,69.77 | IC3.62 62.34,59.19 62.76,59.61 | IC3.99 47.43,69.16 47.52,69.26 | IC3.81 56.43,69.25 56.41,69.26 | IC3.11 43.52,60.69 42.95,60.12
  Top 1.27: STEPDRV5.9 13.14,15.82 13.23,15.92
  Bottom 1.27: STEPDRV6.9 41.14,15.45 40.92,15.67 | STEPDRV7.9 69.14,15.69 69.37,15.92 | STEPDRV8.9 97.14,15.24 97.31,15.41 | STEPDRV4.9 114.92,95.25 113.56,93.9 | STEPDRV3.9 86.92,94.18 86.89,94.15 | STEPDRV2.9 58.92,94.19 58.95,94.15 | STEPDRV1.9 30.92,94.25 31.01,94.15
  other vias: 10.19,65.2 30,58.34 52.6,56.56 45.24,67.74 39.65,59.86 63.27,59.61 17.81,69.77 23.14,70.02
  pour Top (isolate 0.61): 116.36,14.91 6.63,14.91 0.79,20.75 0.79,83.99 11.96,95.17 113.82,95.17 116.36,92.63
  pour Bottom (isolate 0.61): 115.6,14.91 5.87,14.91 0.03,20.75 0.03,83.99 11.2,95.17 113.06,95.17 115.6,92.63
GND1
  Top 1.016: L2.2 113.38,62 GND.P$1
  pour Bottom (isolate 0.61, no thermals): 11.71,103.3 121.69,103.3 128.8,96.19 128.8,58.09 126.26,55.55 121.69,55.55 118.39,58.85 118.39,96.69 11.46,96.69
  pour Bottom (isolate 0.61, no thermals): 11.96,13.89 117.63,13.89 124.74,21 124.74,58.09 129.31,58.09 129.31,17.95 128.3,17.45 117.88,7.03 11.96,7.03
M1_1A
  Top 1.016: STEPDRV1.12 X1.P$2
M1_1B
  Top 1.016: STEPDRV1.11 X1.P$1
M1_2A
  Top 1.016: STEPDRV1.13 X1.P$3
M1_2B
  Top 1.016: STEPDRV1.14 X1.P$4
M2_1A
  Top 1.016: STEPDRV2.12 X2.P$2
M2_1B
  Top 1.016: STEPDRV2.11 X2.P$1
M2_2A
  Top 1.016: STEPDRV2.13 X2.P$3
M2_2B
  Top 1.016: STEPDRV2.14 X2.P$4
M3_1A
  Top 1.016: STEPDRV3.12 X3.P$2
M3_1B
  Top 1.016: STEPDRV3.11 X3.P$1
M3_2A
  Top 1.016: STEPDRV3.13 X3.P$3
M3_2B
  Top 1.016: STEPDRV3.14 X3.P$4
M4_1A
  Top 1.016: STEPDRV4.12 X4.P$2
M4_1B
  Top 1.016: STEPDRV4.11 X4.P$1
M4_2A
  Top 1.016: STEPDRV4.13 X4.P$3
M4_2B
  Top 1.016: STEPDRV4.14 X4.P$4
M5_1A
  Top 1.016: STEPDRV5.12 X5.P$2
M5_1B
  Top 1.016: STEPDRV5.11 X5.P$1
M5_2A
  Top 1.016: STEPDRV5.13 X5.P$3
M5_2B
  Top 1.016: STEPDRV5.14 X5.P$4
M6_1A
  Top 1.016: STEPDRV6.12 X6.P$2
M6_1B
  Top 1.016: STEPDRV6.11 X6.P$1
M6_2A
  Top 1.016: STEPDRV6.13 X6.P$3
M6_2B
  Top 1.016: STEPDRV6.14 X6.P$4
M7_1A
  Top 1.016: STEPDRV7.12 X7.P$2
M7_1B
  Top 1.016: STEPDRV7.11 X7.P$1
M7_2A
  Top 1.016: STEPDRV7.13 X7.P$3
M7_2B
  Top 1.016: STEPDRV7.14 X7.P$4
M8_1A
  Top 1.016: STEPDRV8.12 X8.P$2
M8_1B
  Top 1.016: STEPDRV8.11 X8.P$1
M8_2A
  Top 1.016: STEPDRV8.13 X8.P$3
M8_2B
  Top 1.016: STEPDRV8.14 X8.P$4
N$1
  Top 0.508: U$1.VBUS 9.98,70.07 13.49,73.58 15.4,73.58 L1.2
N$2
  Top 0.305: U$1.D- 16.53,69.27 17.3,68.5 17.3,67.99 16.88,67.58 IC2.16
N$3
  Top 0.406: R1.1 88.87,64 ON.A
N$4
  Bottom 1.27: STEPDRV2.6 STEPDRV2.5
N$5
  Bottom 1.27: STEPDRV3.5 STEPDRV3.6
N$6
  Top 0.305: IC2.15 11.48,68.22 11.2,68.5 7.65,68.5 U$1.D+
N$8
  Bottom 1.27: STEPDRV1.5 STEPDRV1.6
N$9
  Bottom 1.27: STEPDRV4.6 STEPDRV4.5
N$10
  Bottom 1.27: STEPDRV5.6 STEPDRV5.5
N$11
  Bottom 1.27: STEPDRV6.5 STEPDRV6.6
N$12
  Bottom 1.27: STEPDRV7.6 STEPDRV7.5
N$13
  Bottom 1.27: STEPDRV8.6 STEPDRV8.5
N$14  (via drill 0.6)
  Top 0.305: v20.09,71.29 21.54,72.49 28.98,72.49 C12.2 | IC2.17 12.52,66.92 v12.47,66.98
  Bottom 0.305: v20.09,71.29 14.25,71.29 13.23,70.28 13.23,67.74 v12.47,66.98
N$15
  Top 1.016: D1.C 106.36,47.83 L3.2
N$16
  Top 0.508: TX.K R4.1
N$17
  Top 0.508: RX.K 5.3,61 R5.1
N$18
  Top 1.016: C15.2 7.62,78.12 U$1.MTN2 U$1.MTN1 U$1.MTN3 U$1.MTN4
N$30
  Top 0.305: IC2.23 12.59,63.02 11.46,61.9 11.46,55.53 R4.2
N$31
  Top 0.305: IC2.22 11.2,63.67 9.93,62.4 R5.2
N$57  (via drill 0.6)
  Top 0.305: IC2.11 24.1,66.28 v27.2,63.17 | R8.2 23.76,54.9 v23.9,55.04
  Bottom 0.305: v27.2,63.17 27.2,58.34 v23.9,55.04 23.76,54.9 23.14,54.9 19.58,51.34 19.58,47.42 18.06,45.89 15.52,45.89 13.74,44.12 13.74,41.58 8.01,35.84 JP1.CTS
N$59
  Top 0.305: R9.1 31.03,51.51 S1.1
N$60  (via drill 0.6)
  Top 0.305: R2.1 R3.2 14.03,56.02 13.49,56.56 v12.73,56.56 | v11.71,64.94 12.39,65.88 12.47,65.96 14,65.96 14.33,65.62 IC2.19
  Bottom 0.305: v11.71,64.94 11.71,57.58 v12.73,56.56
PB1  (via drill 0.6)
  Top 0.305: v38.13,57.32 40.67,57.32 41.8,56.19 IC3.20
  Bottom 0.305: ICSP.3 33.5,45.58 34.06,46.15 34.06,53.26 v38.13,57.32
PB2  (via drill 0.6)
  Top 0.305: IC3.21 40.52,55.69 v39.9,56.31
  Bottom 0.305: v39.9,56.31 39.9,35.99 37.36,33.45 34.32,33.45 33.55,34.21 33.55,35.2 ICSP.4
PB3  (via drill 0.6)
  Top 0.305: v38.13,55.29 38.13,55.19 IC3.22
  Bottom 0.305: ICSP.1 36.04,44.94 35.08,45.89 35.08,52.24 v38.13,55.29
RESET
  Top 0.305: IC3.30 48.93,50.34 47.02,48.43 32.47,48.43 S1.3
  Top 0.61: S1.3 28.77,46.74 28.03,46 R10.2 | ICSP.5 30.96,44.07 30.03,45 28.13,45 R10.2 | C14.2 C13.2 24.8,44 25.68,44.88 28,44.88 R10.2
RX
  Top 0.305: R6.1 40.61,74.4 42.19,72.82 42.19,66.21 43.21,65.2 IC3.2
RXI  (via drill 0.6)
  Top 0.305: v24.41,63.17 23.62,62.38 IC2.5 20.57,62.38 v15.52,57.32 | v25.43,67.48 25.43,69.26 v27.2,71.04 | R7.2 36.99,72.19 v36.86,72.06
  Bottom 0.305: v24.41,63.17 24.41,66.47 v25.43,67.48 | v27.2,71.04 35.84,71.04 v36.86,72.06 | v15.52,57.32 15.52,53.51 11.71,49.7 5.61,49.7 2.57,46.66 2.57,44.62 3.58,43.61 5.88,43.61 JP1.RXI
S1  (via drill 0.6)
  Top 0.305: v33.05,54.78 34.06,53.77 38.63,53.77 39.56,54.69 IC3.23
  Bottom 0.305: X9.P$3 25.43,40.13 25.43,49.2 31.01,54.78 v33.05,54.78
S2  (via drill 0.6)
  Top 0.305: v27.97,48.69 28.73,49.45 38.63,49.45 40.41,51.23 40.41,52.75 41.85,54.19 IC3.24
  Bottom 0.305: X9.P$4 27.2,39.37 27.2,47.93 v27.97,48.69
STEP_1  (via drill 0.6)
  Top 0.305: IC3.6 39.88,63.19 38.63,64.44 v38.63,65.96
  Bottom 0.305: v38.63,65.96 38.63,68.5 37.87,69.26 37.87,69.77 39.9,71.8 39.9,76.63 35.33,81.2 29.49,81.2 28.47,82.22 28.47,84.55 STEPDRV1.7
STEP_2  (via drill 0.6)
  Top 0.305: IC3.7 42.73,62.69 v42.19,62.15 | v43.46,70.53 43.46,74.85 48.29,79.68 54.38,79.68 56.41,81.71 56.41,84.61 STEPDRV2.7
  Bottom 0.305: v42.19,62.15 42.19,69.26 v43.46,70.53
STEP_3  (via drill 0.6)
  Top 0.305: IC3.1 44.24,65.69 43.46,66.47 43.46,68.5 44.98,70.02 44.98,74.6 49.05,78.66 56.16,78.66 v56.92,79.42
  Bottom 0.305: v56.92,79.42 57.94,79.42 62,83.49 65.81,83.49 69.11,80.18 82.58,80.18 84.35,81.96 84.35,84.63 STEPDRV3.7
STEP_4  (via drill 0.6)
  Top 0.305: v39.9,69.52 39.9,64.69 40.92,63.67 44.91,63.67 IC3.5
  Bottom 0.305: STEPDRV4.7 112.38,81.79 107.21,76.63 69.88,76.63 66.07,72.82 43.21,72.82 v39.9,69.52
STEP_5  (via drill 0.6)
  Top 0.305: IC3.15 38.79,58.69 38.13,59.36 37.36,59.36 v34.57,56.56
  Bottom 0.305: v34.57,56.56 34.57,54.78 33.05,53.26 33.05,46.15 28.98,42.08 28.98,36.5 22.89,30.4 17.3,30.4 15.77,28.88 15.77,25.45 STEPDRV5.7
STEP_6  (via drill 0.6)
  Top 0.305: IC3.16 42.55,58.19 v41.94,57.58
  Bottom 0.305: v41.94,57.58 41.94,31.42 43.71,29.64 43.71,25.39 STEPDRV6.7
STEP_7  (via drill 0.6)
  Top 0.305: IC3.17 47.13,57.69 v47.78,58.34 | v62,49.7 63.02,49.7 71.65,41.07 71.65,25.37 STEPDRV7.7
  Bottom 0.305: v47.78,58.34 47.78,57.83 49.81,55.8 49.81,52.24 53.37,48.69 60.99,48.69 v62,49.7
STEP_8  (via drill 0.6)
  Top 0.305: IC3.18 46.39,57.19 v47.78,55.8
  Bottom 0.305: v47.78,55.8 47.78,52.75 52.86,47.67 68.86,47.67 94.26,22.27 99.09,22.27 99.59,22.78 99.59,25.27 STEPDRV8.7
TX
  Top 0.305: R7.1 40.61,71.35 41.43,70.53 41.43,65.45 42.19,64.69 IC3.3
TXO  (via drill 0.6)
  Top 0.305: v24.66,59.1 23.99,59.77 IC2.1 20.26,59.77 v18.06,57.58 | R6.2 36.92,75.17 v36.86,75.1 | JP1.TXO 8.26,40.92 11.96,44.62 11.96,47.67 v14.76,50.47
  Bottom 0.305: v24.66,59.1 24.66,61.13 25.93,62.4 25.93,64.94 26.95,65.96 31.01,65.96 32.28,67.23 32.28,68.5 33.81,70.02 36.86,70.02 38.63,71.8 38.63,73.33 v36.86,75.1 | v14.76,50.47 14.76,50.97 17.55,53.77 17.55,57.07 v18.06,57.58
VIN
  Top 1.016: IC1.IN 104.69,51.24 101.63,48.18 101.63,46.36 L3.1 96.6,46.25 C1.+ 94.33,43.98 C7.2
XTAL1
  Top 0.305: IC3.34 50.93,49.35 54.64,45.64 54.64,41.9 Q1.1 58.38,45.64 C4.1
XTAL2
  Top 0.305: IC3.33 50.43,42.51 Q1.2 45.77,45.64 C5.1

### Text on the board
tPlace: 2B | 2A | 1A | 1B | 2B | 2A | 1A | 1B | 2B | 2A | 1A | 1B | 2B | 2A | 1A | 1B | D_SENSOR | RST | SCK | MISO | GND | GND | 5V | S1 | S2 | GND | 5V | MOSI | 1B | 1A | 2A | 2B | 1B | 1A | 2A | 2B | 1B | 1A | 2A | 2B | 1B | 1A | 2A | 2B